# Altium schematic sheet 05_POWER_old.SchDoc: WMI (POWER)
size A4
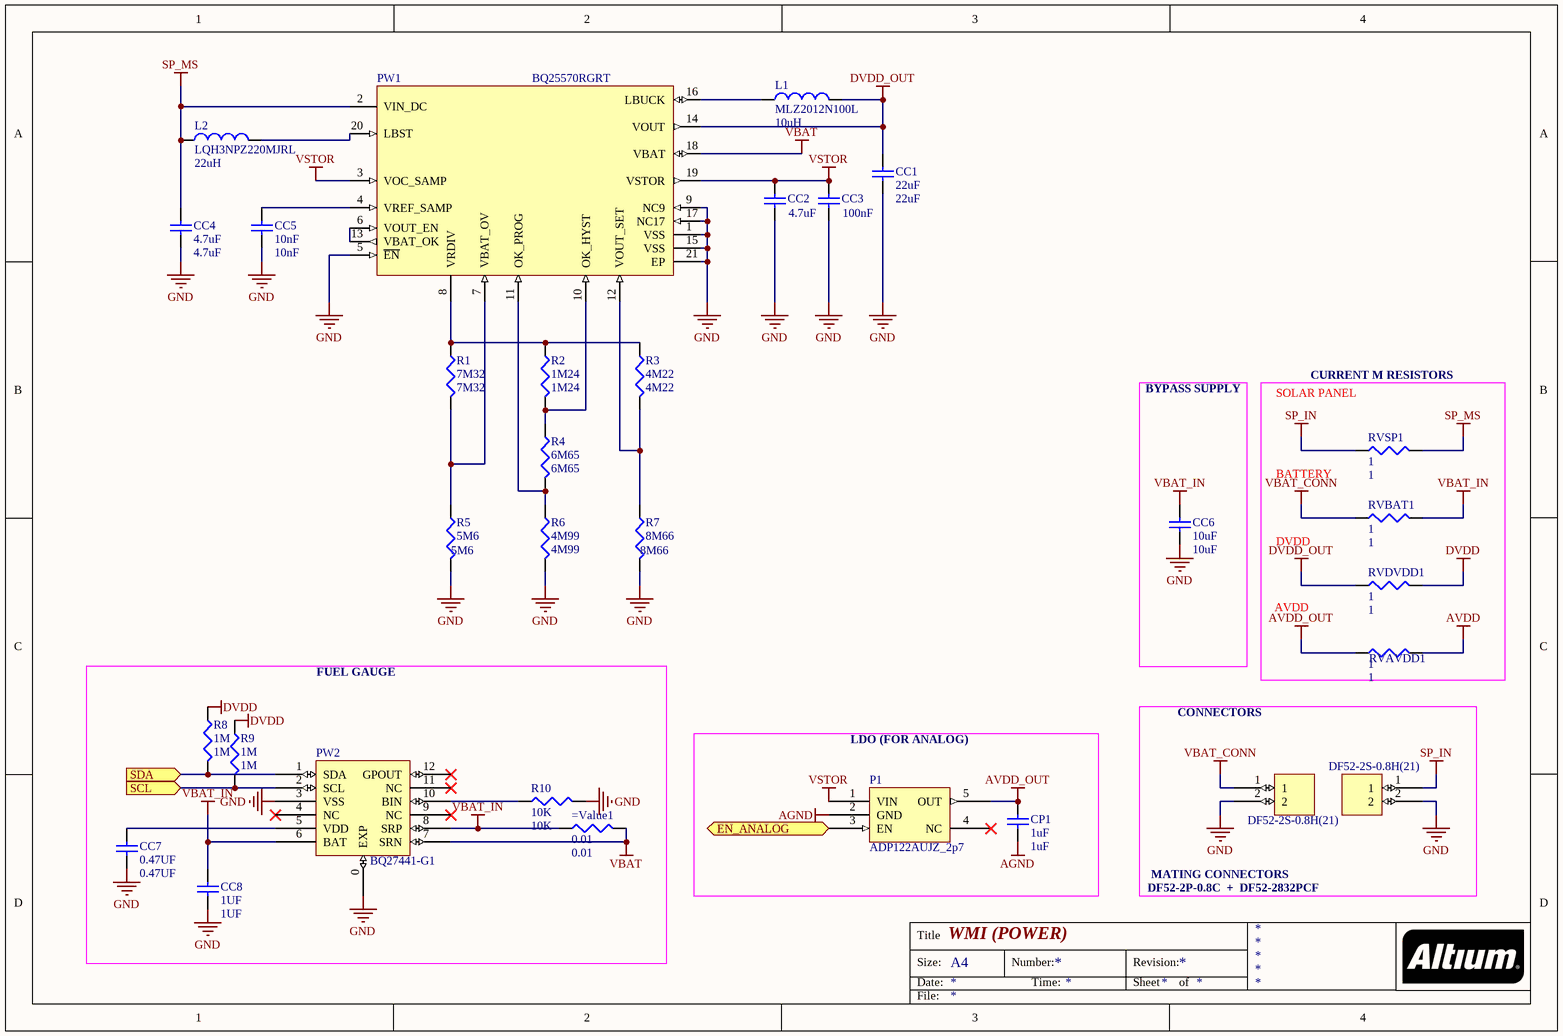
[diagram p0: 05_POWER_old.SchDoc]

## Parts
=Value1  0.01  [0402]
CC1  22uF  [J1-0603]
CC2  4.7uF  [0402]
CC3  100nF  [0603]
CC4  4.7uF  [0402]
CC5  10nF  [J1-0603]
CC6  10uF  [0402]
CC7  0.47UF  [0402]
CC8  1UF  [0402]
CONN_BAT1  DF52-2S-0.8H(21)  [DF52-2S-0.8H(21)]
CONN_P_S1  DF52-2S-0.8H(21)  [DF52-2S-0.8H(21)]
CP1  1uF  [0402]
L1  MLZ2012N100L  value 10uH  [6-0805_N]
L2  LQH3NPZ220MJRL  value 22uH  [1212_PCK]
P1  ADP122AUJZ_2p7  [UJ-5_N]
PW1  BQ25570RGRT  [VQFN20]
PW2  BQ27441-G1  [DRZ12_SMALL]
R1  7M32  [0402]
R2  1M24  [0402]
R3  4M22  [0402]
R4  6M65  [0402]
R5  5M6  [0402]
R6  4M99  [0402]
R7  8M66  [0402]
R8  1M  [0402]
R9  1M  [0402]
R10  10K  [0402]
RVAVDD1  1  [J1-0603]
RVBAT1  1  [J1-0603]
RVDVDD1  1  [J1-0603]
RVSP1  1  [J1-0603]

## Blocks framed on the sheet
BYPASS SUPPLY: CC6
CURRENT M RESISTORS: RVAVDD1 RVBAT1 RVDVDD1 RVSP1
FUEL GAUGE: =Value1 CC7 CC8 PW2 R8-R10
LDO (FOR ANALOG): CP1 P1

## Ports
EN_ANALOG (in), SCL (in), SDA (in)

## Nets
AGND: CP1.1 P1.2(GND)
AVDD: RVAVDD1.2
AVDD_OUT: CP1.2 P1.5(OUT) RVAVDD1.1
DVDD: R8.1 R9.1 RVDVDD1.2
DVDD_OUT: CC1.2 L1.2 PW1.14(VOUT) RVDVDD1.1
GND: CC1.1 CC2.1 CC3.1 CC4.1 CC5.1 CC6.1 CC7.1 CC8.1 CONN_BAT1.2 CONN_P_S1.2 PW1.1(VSS) PW1.5(~{EN}) PW1.9(NC9) PW1.15(VSS) PW1.17(NC17) PW1.21(EP) PW2.0(EXP) PW2.3(VSS) R5.2 R6.2 R7.2 R10.2
SP_IN: CONN_P_S1.1 RVSP1.1
SP_MS: CC4.2 L2.1 PW1.2(VIN_DC) RVSP1.2
VBAT: =Value1.2 PW1.18(VBAT) PW2.7(SRN)
VBAT_CONN: CONN_BAT1.1 RVBAT1.1
VBAT_IN: =Value1.1 CC6.2 CC8.2 PW2.6(BAT) PW2.8(SRP) RVBAT1.2
VSTOR: CC2.2 CC3.2 P1.1(VIN) PW1.3(VOC_SAMP) PW1.19(VSTOR)
EN_ANALOG: P1.3(EN) ; port EN_ANALOG
SCL: PW2.2(SCL) R9.2 ; port SCL
SDA: PW2.1(SDA) R8.2 ; port SDA
NetCC5_2: CC5.2 PW1.4(VREF_SAMP)
NetCC7_2: CC7.2 PW2.5(VDD)
NetL1_1: L1.1 PW1.16(LBUCK)
NetL2_2: L2.2 PW1.20(LBST)
NetPW1_6: PW1.6(VOUT_EN) PW1.13(VBAT_OK)
NetPW1_7: PW1.7(VBAT_OV) R1.2 R5.1
NetPW1_8: PW1.8(VRDIV) R1.1 R2.1 R3.1
NetPW1_10: PW1.10(OK_HYST) R2.2 R4.1
NetPW1_11: PW1.11(OK_PROG) R4.2 R6.1
NetPW1_12: PW1.12(VOUT_SET) R3.2 R7.1
NetPW2_10: PW2.10(BIN) R10.1

Not connected (* = marked no-connect by the designer): P1 4(NC)*; PW2 4(NC)* 9(NC)* 11(NC)* 12(GPOUT)*

## Notes on the sheet
- (near RVSP1) SOLAR PANEL
- (near RVSP1) BATTERY
- (near RVBAT1) DVDD
- (near RVDVDD1) AVDD
- CONNECTORS
- MATING CONNECTORS
- DF52-2P-0.8C  +  DF52-2832PCF
- Title
- Size:
- Date:
- A4
- Number:
- Time:
- Revision:
- Sheet
- of
- File:

## Library data of the parts
=Value1 R1-R10 RVAVDD1 RVBAT1 RVDVDD1 RVSP1 = Res3: Resistor; Published: 8-Jun-2000; LatestRevisionDate: 29-May-2009; LatestRevisionNote: IPC-7351 Footprint Added.; PackageReference: J1-0603; Publisher: Altium Limited; PackageDescription: Chip Resistor
  =Value1: Value: 0.01
  R1: Value: 7M32
  R2: Value: 1M24
  R3: Value: 4M22
  R4: Value: 6M65
  R5: Value: 5M6
  R6: Value: 4M99
  R7: Value: 8M66
  R8 R9: Value: 1M
  R10: Value: 10K
  RVAVDD1 RVBAT1 RVDVDD1 RVSP1: Value: 1
CC1-CC8 CP1 = Cap Semi: Capacitor (Semiconductor SIM Model); Published: 8-Jun-2000; LatestRevisionDate: 29-May-2009; LatestRevisionNote: IPC-7351 Footprint Added.; PackageReference: C1206; Publisher: Altium Limited; PackageDescription: Chip Capacitor
  CC1: Value: 22uF
  CC2 CC4: Value: 4.7uF
  CC3: Value: 100nF
  CC5: Value: 10nF
  CC6: Value: 10uF
  CC7: Value: 0.47UF
  CC8: Value: 1UF
  CP1: Value: 1uF
L1 L2 = Inductor: Code_IEC: 1005; Published: 8-Jun-2000; LatestRevisionDate: 29-May-2009; LatestRevisionNote: IPC-7351 Footprint Added.; PackageReference: 0402-A; Publisher: Altium Limited; PackageDescription: Chip Inductor; Code_JEITA: 0402
P1 = ADP122: Regulator
PW1 = BQ25570RGRT: IC ENERGY HARV CTRLR BATT 20VQFN; Manufacturer: Texas Instruments; Current - Supply: 488nA; Voltage - Supply: 0.12 V ~ 4 V; Packaging: Tape & Reel (TR); Applications: Energy Harvesting; Operating Temperature: -40°C ~ 125°C; Mounting Type: Surface Mount; Package / Case: 20-VFQFN Exposed Pad; Supplier Device Package: 20-VQFN (3.5x3.5); P/N: BQ25570RGRT; Supplier: Digi-Key; Supplier Part Number: 296-37014-2-ND; ComponentLink1Description: bq25570.pdf; ComponentLink1URL: http://www.ti.com/lit/ds/symlink/bq25570.pdf